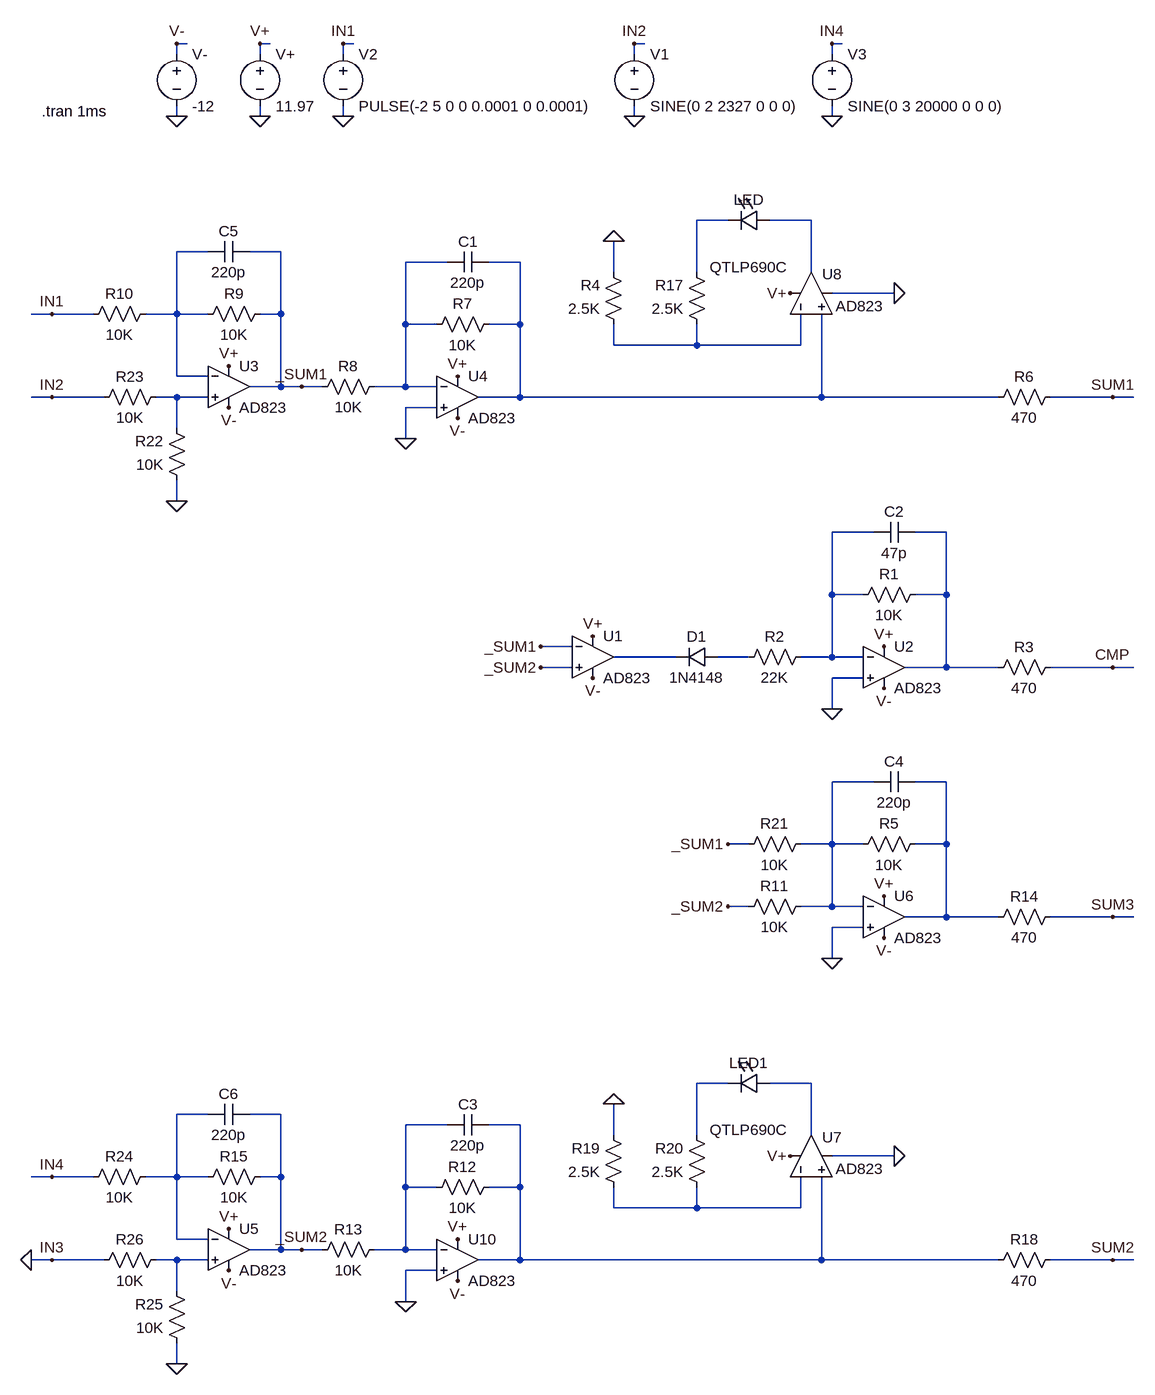
[diagram p0: schematic Mixer.asc]
Mixer.asc, the LTspice schematic file:
Version 4
SHEET 1 1408 972
WIRE -1504 -1440 -1520 -1440
WIRE -1376 -1440 -1392 -1440
WIRE -1248 -1440 -1264 -1440
WIRE -800 -1440 -816 -1440
WIRE -496 -1440 -512 -1440
WIRE -1520 -1424 -1520 -1440
WIRE -1392 -1424 -1392 -1440
WIRE -1264 -1424 -1264 -1440
WIRE -816 -1424 -816 -1440
WIRE -512 -1424 -512 -1440
WIRE -1520 -1328 -1520 -1344
WIRE -1392 -1328 -1392 -1344
WIRE -1264 -1328 -1264 -1344
WIRE -816 -1328 -816 -1344
WIRE -512 -1328 -512 -1344
WIRE -672 -1168 -720 -1168
WIRE -544 -1168 -608 -1168
WIRE -1472 -1120 -1520 -1120
WIRE -1360 -1120 -1408 -1120
WIRE -1104 -1104 -1168 -1104
WIRE -992 -1104 -1040 -1104
WIRE -848 -1088 -848 -1136
WIRE -720 -1088 -720 -1168
WIRE -544 -1088 -544 -1168
WIRE -416 -1056 -512 -1056
WIRE -1712 -1024 -1744 -1024
WIRE -1648 -1024 -1712 -1024
WIRE -1520 -1024 -1520 -1120
WIRE -1520 -1024 -1568 -1024
WIRE -1472 -1024 -1520 -1024
WIRE -1360 -1024 -1360 -1120
WIRE -1360 -1024 -1392 -1024
WIRE -1168 -1008 -1168 -1104
WIRE -1120 -1008 -1168 -1008
WIRE -992 -1008 -992 -1104
WIRE -992 -1008 -1040 -1008
WIRE -848 -976 -848 -1008
WIRE -720 -976 -720 -1008
WIRE -720 -976 -848 -976
WIRE -560 -976 -560 -1024
WIRE -560 -976 -720 -976
WIRE -1520 -928 -1520 -1024
WIRE -1472 -928 -1520 -928
WIRE -1360 -912 -1360 -1024
WIRE -1360 -912 -1408 -912
WIRE -1328 -912 -1360 -912
WIRE -1296 -912 -1328 -912
WIRE -1168 -912 -1168 -1008
WIRE -1168 -912 -1216 -912
WIRE -1120 -912 -1168 -912
WIRE -1712 -896 -1744 -896
WIRE -1632 -896 -1712 -896
WIRE -1520 -896 -1552 -896
WIRE -1472 -896 -1520 -896
WIRE -992 -896 -992 -1008
WIRE -992 -896 -1056 -896
WIRE -528 -896 -528 -1024
WIRE -528 -896 -992 -896
WIRE -256 -896 -528 -896
WIRE -80 -896 -176 -896
WIRE -48 -896 -80 -896
WIRE -1120 -880 -1168 -880
WIRE -1520 -848 -1520 -896
WIRE -1168 -832 -1168 -880
WIRE -1520 -736 -1520 -768
WIRE -448 -688 -512 -688
WIRE -336 -688 -384 -688
WIRE -512 -592 -512 -688
WIRE -464 -592 -512 -592
WIRE -336 -592 -336 -688
WIRE -336 -592 -384 -592
WIRE -912 -512 -960 -512
WIRE -752 -496 -848 -496
WIRE -640 -496 -688 -496
WIRE -512 -496 -512 -592
WIRE -512 -496 -560 -496
WIRE -464 -496 -512 -496
WIRE -912 -480 -960 -480
WIRE -336 -480 -336 -592
WIRE -336 -480 -400 -480
WIRE -256 -480 -336 -480
WIRE -80 -480 -176 -480
WIRE -48 -480 -80 -480
WIRE -464 -464 -512 -464
WIRE -512 -416 -512 -464
WIRE -448 -304 -512 -304
WIRE -336 -304 -384 -304
WIRE -640 -208 -672 -208
WIRE -512 -208 -512 -304
WIRE -512 -208 -560 -208
WIRE -464 -208 -512 -208
WIRE -336 -208 -336 -304
WIRE -336 -208 -384 -208
WIRE -640 -112 -672 -112
WIRE -512 -112 -512 -208
WIRE -512 -112 -560 -112
WIRE -464 -112 -512 -112
WIRE -336 -96 -336 -208
WIRE -336 -96 -400 -96
WIRE -256 -96 -336 -96
WIRE -80 -96 -176 -96
WIRE -48 -96 -80 -96
WIRE -464 -80 -512 -80
WIRE -512 -32 -512 -80
WIRE -672 160 -720 160
WIRE -544 160 -608 160
WIRE -1472 208 -1520 208
WIRE -1360 208 -1408 208
WIRE -1104 224 -1168 224
WIRE -992 224 -1040 224
WIRE -848 240 -848 192
WIRE -720 240 -720 160
WIRE -544 240 -544 160
WIRE -416 272 -512 272
WIRE -1712 304 -1744 304
WIRE -1648 304 -1712 304
WIRE -1520 304 -1520 208
WIRE -1520 304 -1568 304
WIRE -1472 304 -1520 304
WIRE -1360 304 -1360 208
WIRE -1360 304 -1392 304
WIRE -1168 320 -1168 224
WIRE -1120 320 -1168 320
WIRE -992 320 -992 224
WIRE -992 320 -1040 320
WIRE -848 352 -848 320
WIRE -720 352 -720 320
WIRE -720 352 -848 352
WIRE -560 352 -560 304
WIRE -560 352 -720 352
WIRE -1520 400 -1520 304
WIRE -1472 400 -1520 400
WIRE -1360 416 -1360 304
WIRE -1360 416 -1408 416
WIRE -1328 416 -1360 416
WIRE -1296 416 -1328 416
WIRE -1168 416 -1168 320
WIRE -1168 416 -1216 416
WIRE -1120 416 -1168 416
WIRE -1712 432 -1744 432
WIRE -1632 432 -1712 432
WIRE -1520 432 -1552 432
WIRE -1472 432 -1520 432
WIRE -992 432 -992 320
WIRE -992 432 -1056 432
WIRE -528 432 -528 304
WIRE -528 432 -992 432
WIRE -256 432 -528 432
WIRE -80 432 -176 432
WIRE -48 432 -80 432
WIRE -1120 448 -1168 448
WIRE -1520 480 -1520 432
WIRE -1168 496 -1168 448
WIRE -1520 592 -1520 560
FLAG -1392 -1328 0
FLAG -1264 -1328 0
FLAG -1392 -1440 V+
FLAG -1520 -1328 0
FLAG -1520 -1440 V-
FLAG -880 -528 V+
FLAG -80 -480 CMP
FLAG -1712 -1024 IN1
FLAG -1088 -928 V+
FLAG -1088 -864 V-
FLAG -1440 -880 V-
FLAG -1440 -944 V+
FLAG -80 -896 SUM1
FLAG -1168 -832 0
FLAG -1520 -736 0
FLAG -1264 -1440 IN1
FLAG -576 -1056 V+
FLAG -848 -1136 0
FLAG -416 -1056 0
FLAG -880 -464 V-
FLAG -432 -512 V+
FLAG -432 -448 V-
FLAG -512 -416 0
FLAG -1088 400 V+
FLAG -1088 464 V-
FLAG -1440 448 V-
FLAG -1440 384 V+
FLAG -1168 496 0
FLAG -80 432 SUM2
FLAG -576 272 V+
FLAG -848 192 0
FLAG -416 272 0
FLAG -432 -128 V+
FLAG -432 -64 V-
FLAG -512 -32 0
FLAG -80 -96 SUM3
FLAG -1328 -912 _SUM1
FLAG -1328 416 _SUM2
FLAG -960 -512 _SUM1
FLAG -960 -480 _SUM2
FLAG -672 -208 _SUM1
FLAG -672 -112 _SUM2
FLAG -816 -1328 0
FLAG -816 -1440 IN2
FLAG -1712 -896 IN2
FLAG -1712 304 IN4
FLAG -1520 592 0
FLAG -1712 432 IN3
FLAG -512 -1328 0
FLAG -512 -1440 IN4
FLAG -1744 432 0
SYMBOL voltage -1392 -1440 R0
SYMATTR InstName V+
SYMATTR Value 11.97
SYMBOL voltage -1264 -1440 R0
SYMATTR InstName V2
SYMATTR Value PULSE(-2 5 0 0 0.0001 0 0.0001)
SYMBOL OpAmps/AD823 -880 -560 R0
SYMATTR InstName U1
SYMBOL voltage -1520 -1440 R0
SYMATTR InstName V-
SYMATTR Value -12
SYMBOL Res -656 -480 R270
WINDOW 0 32 56 VTop 2
WINDOW 3 0 56 VBottom 2
SYMATTR InstName R2
SYMATTR Value 22K
SYMBOL Res -160 -496 R90
WINDOW 0 0 56 VBottom 2
WINDOW 3 32 56 VTop 2
SYMATTR InstName R3
SYMATTR Value 470
SYMBOL OpAmps/AD823 -1440 -976 R0
SYMATTR InstName U3
SYMBOL OpAmps/AD823 -1088 -960 R0
SYMATTR InstName U4
SYMBOL Res -160 -912 R90
WINDOW 0 0 56 VBottom 2
WINDOW 3 32 56 VTop 2
SYMATTR InstName R6
SYMATTR Value 470
SYMBOL Res -1024 -1024 R90
WINDOW 0 0 56 VBottom 2
WINDOW 3 32 56 VTop 2
SYMATTR InstName R7
SYMATTR Value 10K
SYMBOL Res -1200 -928 R90
WINDOW 0 0 56 VBottom 2
WINDOW 3 32 56 VTop 2
SYMATTR InstName R8
SYMATTR Value 10K
SYMBOL Res -1376 -1040 R90
WINDOW 0 0 56 VBottom 2
WINDOW 3 32 56 VTop 2
SYMATTR InstName R9
SYMATTR Value 10K
SYMBOL Res -1552 -1040 R90
WINDOW 0 0 56 VBottom 2
WINDOW 3 32 56 VTop 2
SYMATTR InstName R10
SYMATTR Value 10K
SYMBOL Cap -1040 -1120 R90
WINDOW 0 0 32 VBottom 2
WINDOW 3 32 32 VTop 2
SYMATTR InstName C1
SYMATTR Value 220p
SYMBOL OpAmps/AD823 -608 -1056 R270
WINDOW 0 29 81 VRight 2
WINDOW 3 -20 102 VRight 2
SYMATTR InstName U8
SYMBOL LED -608 -1184 R90
WINDOW 0 0 32 VBottom 2
WINDOW 3 72 32 VTop 2
SYMATTR InstName LED
SYMATTR Value QTLP690C
SYMBOL Res -832 -992 R180
WINDOW 0 36 76 Left 2
WINDOW 3 36 40 Left 2
SYMATTR InstName R4
SYMATTR Value 2.5K
SYMBOL diode -688 -512 R90
WINDOW 0 0 32 VBottom 2
WINDOW 3 32 32 VTop 2
SYMATTR InstName D1
SYMATTR Value 1N4148
SYMBOL OpAmps/AD823 -432 -544 R0
SYMATTR InstName U2
SYMBOL Res -368 -608 R90
WINDOW 0 0 56 VBottom 2
WINDOW 3 32 56 VTop 2
SYMATTR InstName R1
SYMATTR Value 10K
SYMBOL Cap -384 -704 R90
WINDOW 0 0 32 VBottom 2
WINDOW 3 32 32 VTop 2
SYMATTR InstName C2
SYMATTR Value 47p
SYMBOL OpAmps/AD823 -1440 352 R0
SYMATTR InstName U5
SYMBOL OpAmps/AD823 -1088 368 R0
SYMATTR InstName U10
SYMBOL Res -1024 304 R90
WINDOW 0 0 56 VBottom 2
WINDOW 3 32 56 VTop 2
SYMATTR InstName R12
SYMATTR Value 10K
SYMBOL Res -1200 400 R90
WINDOW 0 0 56 VBottom 2
WINDOW 3 32 56 VTop 2
SYMATTR InstName R13
SYMATTR Value 10K
SYMBOL Res -1376 288 R90
WINDOW 0 0 56 VBottom 2
WINDOW 3 32 56 VTop 2
SYMATTR InstName R15
SYMATTR Value 10K
SYMBOL Cap -1040 208 R90
WINDOW 0 0 32 VBottom 2
WINDOW 3 32 32 VTop 2
SYMATTR InstName C3
SYMATTR Value 220p
SYMBOL Res -704 -992 R180
WINDOW 0 36 76 Left 2
WINDOW 3 36 40 Left 2
SYMATTR InstName R17
SYMATTR Value 2.5K
SYMBOL Res -160 416 R90
WINDOW 0 0 56 VBottom 2
WINDOW 3 32 56 VTop 2
SYMATTR InstName R18
SYMATTR Value 470
SYMBOL OpAmps/AD823 -608 272 R270
WINDOW 0 29 81 VRight 2
WINDOW 3 -20 102 VRight 2
SYMATTR InstName U7
SYMBOL LED -608 144 R90
WINDOW 0 0 32 VBottom 2
WINDOW 3 72 32 VTop 2
SYMATTR InstName LED1
SYMATTR Value QTLP690C
SYMBOL Res -832 336 R180
WINDOW 0 36 76 Left 2
WINDOW 3 36 40 Left 2
SYMATTR InstName R19
SYMATTR Value 2.5K
SYMBOL Res -704 336 R180
WINDOW 0 36 76 Left 2
WINDOW 3 36 40 Left 2
SYMATTR InstName R20
SYMATTR Value 2.5K
SYMBOL OpAmps/AD823 -432 -160 R0
SYMATTR InstName U6
SYMBOL Res -368 -224 R90
WINDOW 0 0 56 VBottom 2
WINDOW 3 32 56 VTop 2
SYMATTR InstName R5
SYMATTR Value 10K
SYMBOL Res -544 -128 R90
WINDOW 0 0 56 VBottom 2
WINDOW 3 32 56 VTop 2
SYMATTR InstName R11
SYMATTR Value 10K
SYMBOL Cap -384 -320 R90
WINDOW 0 0 32 VBottom 2
WINDOW 3 32 32 VTop 2
SYMATTR InstName C4
SYMATTR Value 220p
SYMBOL Res -160 -112 R90
WINDOW 0 0 56 VBottom 2
WINDOW 3 32 56 VTop 2
SYMATTR InstName R14
SYMATTR Value 470
SYMBOL Res -544 -224 R90
WINDOW 0 0 56 VBottom 2
WINDOW 3 32 56 VTop 2
SYMATTR InstName R21
SYMATTR Value 10K
SYMBOL voltage -816 -1440 R0
SYMATTR InstName V1
SYMATTR Value SINE(0 2 2327 0 0 0)
SYMBOL Res -1504 -752 R180
WINDOW 0 36 76 Left 2
WINDOW 3 36 40 Left 2
SYMATTR InstName R22
SYMATTR Value 10K
SYMBOL Res -1536 -912 R90
WINDOW 0 0 56 VBottom 2
WINDOW 3 32 56 VTop 2
SYMATTR InstName R23
SYMATTR Value 10K
SYMBOL Res -1552 288 R90
WINDOW 0 0 56 VBottom 2
WINDOW 3 32 56 VTop 2
SYMATTR InstName R24
SYMATTR Value 10K
SYMBOL Res -1504 576 R180
WINDOW 0 36 76 Left 2
WINDOW 3 36 40 Left 2
SYMATTR InstName R25
SYMATTR Value 10K
SYMBOL Res -1536 416 R90
WINDOW 0 0 56 VBottom 2
WINDOW 3 32 56 VTop 2
SYMATTR InstName R26
SYMATTR Value 10K
SYMBOL voltage -512 -1440 R0
SYMATTR InstName V3
SYMATTR Value SINE(0 3 20000 0 0 0)
SYMBOL Cap -1408 -1136 R90
WINDOW 0 0 32 VBottom 2
WINDOW 3 32 32 VTop 2
SYMATTR InstName C5
SYMATTR Value 220p
SYMBOL Cap -1408 192 R90
WINDOW 0 0 32 VBottom 2
WINDOW 3 32 32 VTop 2
SYMATTR InstName C6
SYMATTR Value 220p
TEXT -1728 -1336 Left 2 !.tran 1ms

The netlist it stands for:
* Mixer.asc
V+ V+ 0 11.97
V2 IN1 0 PULSE(-2 5 0 0 0.0001 0 0.0001)
XU1 _SUM2 _SUM1 V+ V- N010 AD823  ; pins In+ In- V+ V- OUT
V- V- 0 -12
R2 N011 N008 22K
R3 CMP N009 470
XU3 N007 N003 V+ V- _SUM1 AD823  ; pins In+ In- V+ V- OUT
XU4 0 N004 V+ V- N005 AD823  ; pins In+ In- V+ V- OUT
R6 SUM1 N005 470
R7 N005 N004 10K
R8 N004 _SUM1 10K
R9 _SUM1 N003 10K
R10 N003 IN1 10K
C1 N005 N004 220p
XU8 N005 N006 V+ 0 N002 AD823  ; pins In+ In- V+ V- OUT
D§LED N002 N001 QTLP690C
R4 N006 0 2.5K
D1 N011 N010 1N4148
XU2 0 N008 V+ V- N009 AD823  ; pins In+ In- V+ V- OUT
R1 N009 N008 10K
C2 N009 N008 47p
XU5 N020 N016 V+ V- _SUM2 AD823  ; pins In+ In- V+ V- OUT
XU10 0 N017 V+ V- N018 AD823  ; pins In+ In- V+ V- OUT
R12 N018 N017 10K
R13 N017 _SUM2 10K
R15 _SUM2 N016 10K
C3 N018 N017 220p
R17 N006 N001 2.5K
R18 SUM2 N018 470
XU7 N018 N019 V+ 0 N015 AD823  ; pins In+ In- V+ V- OUT
D§LED1 N015 N014 QTLP690C
R19 N019 0 2.5K
R20 N019 N014 2.5K
XU6 0 N012 V+ V- N013 AD823  ; pins In+ In- V+ V- OUT
R5 N013 N012 10K
R11 N012 _SUM2 10K
C4 N013 N012 220p
R14 SUM3 N013 470
R21 N012 _SUM1 10K
V1 IN2 0 SINE(0 2 2327 0 0 0)
R22 0 N007 10K
R23 N007 IN2 10K
R24 N016 IN4 10K
R25 0 N020 10K
R26 N020 0 10K
V3 IN4 0 SINE(0 3 20000 0 0 0)
C5 _SUM1 N003 220p
C6 _SUM2 N016 220p
.model D D
.lib standard.dio
.tran 1ms
.lib ADI.lib
.backanno
.end